# Altium project ngh-main.PrjPCB
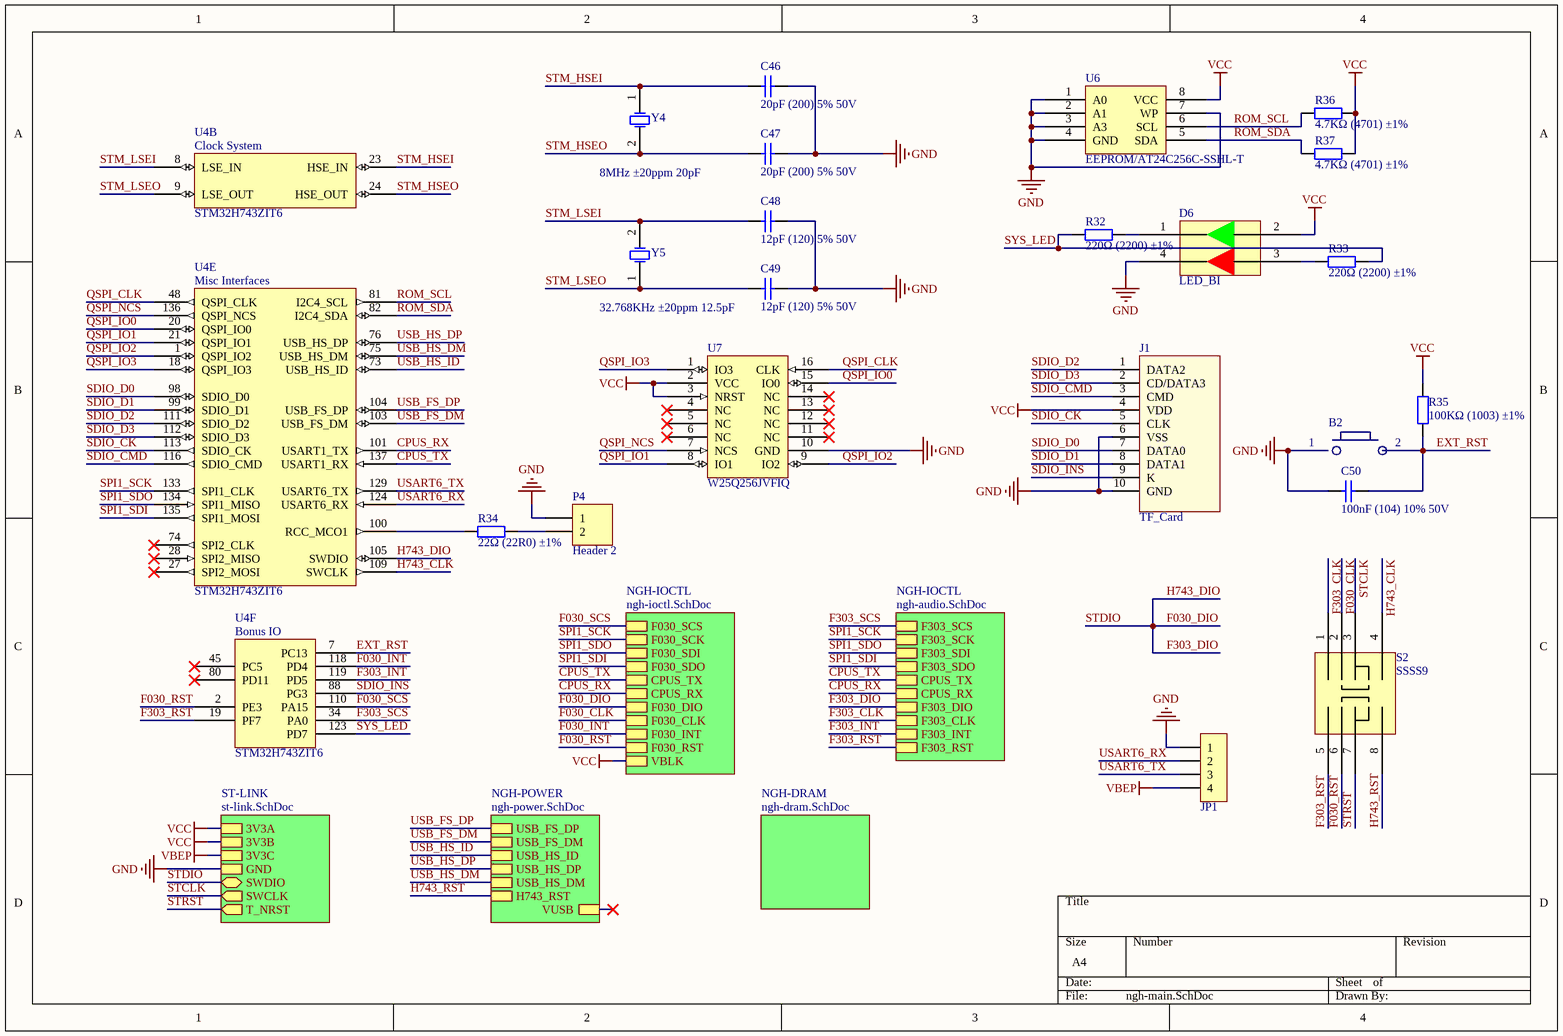
[diagram p0: ngh-main.SchDoc]
7 sheets, 143 parts. Net scope: hierarchical (ports join the sheet entries above them; power ports are global).
Board file: ngh-main.PcbDoc
Sheets:
  ngh-main.SchDoc
    ST-LINK = st-link.SchDoc
    NGH-POWER = ngh-power.SchDoc
    NGH-IOCTL = ngh-ioctl.SchDoc
      NGH-LCD = ngh-lcd.SchDoc
    NGH-IOCTL = ngh-audio.SchDoc
    NGH-DRAM = ngh-dram.SchDoc

## Sheet ngh-main.SchDoc
size A4

### Parts
B2  B1  [MetalButton]  (value not drawn)
C46  20pF (200) 5% 50V  [0603_C]
C47  20pF (200) 5% 50V  [0603_C]
C48  12pF (120) 5% 50V  [0603_C]
C49  12pF (120) 5% 50V  [0603_C]
C50  100nF (104) 10% 50V  [0603_C]
D6  LED_BI  [LED_BI]
J1  TF_Card  [Micro SD]
JP1  HDR-1X4  [HDR2.54-WS-4P]  (value not drawn)
P4  Header 2  [HDR1X2]
R32  220Ω (2200) ±1%  [0603_R]
R33  220Ω (2200) ±1%  [0603_R]
R34  22Ω (22R0) ±1%  [0603_R]
R35  100KΩ (1003) ±1%  [0603_R]
R36  4.7KΩ (4701) ±1%  [0603_R]
R37  4.7KΩ (4701) ±1%  [0603_R]
S2  SSSS9  [SSSS9_5mm_H]
U4  STM32H743ZIT6  [LQFP-144_20x20]  (parts B,E,F of 6)
U6  EEPROM/AT24C256C-SSHL-T  [SOIC-8_150mil]
U7  W25Q256JVFIQ  [SOIC-16_300mil]
Y4  8MHz ±20ppm 20pF  [SMD-5032_2P]
Y5  32.768KHz ±20ppm 12.5pF  [SMD-3215_2P FC - 135]

### Sub-sheets
NGH-DRAM = ngh-dram.SchDoc: no entries
NGH-IOCTL = ngh-ioctl.SchDoc: F030_SCS, F030_SCK, F030_SDI, F030_SDO, CPUS_TX, CPUS_RX, F030_DIO, F030_CLK, F030_INT, F030_RST, VBLK
NGH-IOCTL = ngh-audio.SchDoc: F303_SCS, F303_SCK, F303_SDI, F303_SDO, CPUS_TX, CPUS_RX, F303_DIO, F303_CLK, F303_INT, F303_RST
NGH-POWER = ngh-power.SchDoc: USB_FS_DP, USB_FS_DM, USB_HS_ID, USB_HS_DP, USB_HS_DM, H743_RST, VUSB
ST-LINK = st-link.SchDoc: 3V3A, 3V3B, 3V3C, GND, SWDIO (bidir), SWCLK (out), T_NRST (out)

### Nets
GND: B2.1 C46.2 C47.2 C48.2 C49.2 C50.1 D6.4 J1.6(VSS) J1.10(GND) JP1.1 P4.1 U6.1(A0) U6.2(A1) U6.3(A3) U6.4(GND) U6.7(WP) U7.10(GND) ; sheet ST-LINK/GND
VBEP: JP1.4 ; sheet ST-LINK/3V3C  [project net OUT_3V3C]
VCC: D6.2 J1.4(VDD) R35.2 R36.1 R37.1 U6.8(VCC) U7.2(VCC) U7.3(NRST) ; sheet ST-LINK/3V3A, sheet ST-LINK/3V3B, sheet NGH-IOCTL/VBLK  [project net OUT_3V3A]
CPUS_RX: U4.101(USART1_TX) ; sheet NGH-IOCTL/CPUS_RX, sheet NGH-IOCTL/CPUS_RX
CPUS_TX: U4.137(USART1_RX) ; sheet NGH-IOCTL/CPUS_TX, sheet NGH-IOCTL/CPUS_TX
EXT_RST: B2.2 C50.2 R35.1 U4.7(PC13)
F030_CLK: S2.2 ; sheet NGH-IOCTL/F030_CLK
F030_DIO: U4.105(SWDIO) ; sheet ST-LINK/SWDIO, sheet NGH-IOCTL/F030_DIO, sheet NGH-IOCTL/F303_DIO  [also labelled F303_DIO, H743_DIO, STDIO]
F030_INT: U4.118(PD4) ; sheet NGH-IOCTL/F030_INT
F030_RST: S2.6 U4.2(PE3) ; sheet NGH-IOCTL/F030_RST
F030_SCS: U4.110(PA15) ; sheet NGH-IOCTL/F030_SCS
F303_CLK: S2.1 ; sheet NGH-IOCTL/F303_CLK
F303_INT: U4.119(PD5) ; sheet NGH-IOCTL/F303_INT
F303_RST: S2.5 U4.19(PF7) ; sheet NGH-IOCTL/F303_RST
F303_SCS: U4.34(PA0) ; sheet NGH-IOCTL/F303_SCS
H743_CLK: S2.4 U4.109(SWCLK)
H743_RST: S2.8 ; sheet NGH-POWER/H743_RST
QSPI_CLK: U4.48(QSPI_CLK) U7.16(CLK)
QSPI_IO0: U4.20(QSPI_IO0) U7.15(IO0)
QSPI_IO1: U4.21(QSPI_IO1) U7.8(IO1)
QSPI_IO2: U4.1(QSPI_IO2) U7.9(IO2)
QSPI_IO3: U4.18(QSPI_IO3) U7.1(IO3)
QSPI_NCS: U4.136(QSPI_NCS) U7.7(NCS)
ROM_SCL: R36.2 U4.81(I2C4_SCL) U6.6(SCL)
ROM_SDA: R37.2 U4.82(I2C4_SDA) U6.5(SDA)
SDIO_CK: J1.5(CLK) U4.113(SDIO_CK)
SDIO_CMD: J1.3(CMD) U4.116(SDIO_CMD)
SDIO_D0: J1.7(DATA0) U4.98(SDIO_D0)
SDIO_D1: J1.8(DATA1) U4.99(SDIO_D1)
SDIO_D2: J1.1(DATA2) U4.111(SDIO_D2)
SDIO_D3: J1.2(CD/DATA3) U4.112(SDIO_D3)
SDIO_INS: J1.9(K) U4.88(PG3)
SPI1_SCK: U4.133(SPI1_CLK) ; sheet NGH-IOCTL/F030_SCK, sheet NGH-IOCTL/F303_SCK
SPI1_SDI: U4.135(SPI1_MOSI) ; sheet NGH-IOCTL/F030_SDO, sheet NGH-IOCTL/F303_SDO
SPI1_SDO: U4.134(SPI1_MISO) ; sheet NGH-IOCTL/F030_SDI, sheet NGH-IOCTL/F303_SDI
STCLK: S2.3 ; sheet ST-LINK/SWCLK
STM_HSEI: C46.1 U4.23(HSE_IN) Y4.1(OSC1)
STM_HSEO: C47.1 U4.24(HSE_OUT) Y4.2(OSC2)
STM_LSEI: C48.1 U4.8(LSE_IN) Y5.2(OSC2)
STM_LSEO: C49.1 U4.9(LSE_OUT) Y5.1(OSC1)
STRST: S2.7 ; sheet ST-LINK/T_NRST
SYS_LED: R32.1 R33.2 U4.123(PD7)
USART6_RX: JP1.2 U4.124(USART6_RX)
USART6_TX: JP1.3 U4.129(USART6_TX)
USB_FS_DM: U4.103(USB_FS_DM) ; sheet NGH-POWER/USB_FS_DM
USB_FS_DP: U4.104(USB_FS_DP) ; sheet NGH-POWER/USB_FS_DP
USB_HS_DM: U4.75(USB_HS_DM) ; sheet NGH-POWER/USB_HS_DM
USB_HS_DP: U4.76(USB_HS_DP) ; sheet NGH-POWER/USB_HS_DP
USB_HS_ID: U4.73(USB_HS_ID) ; sheet NGH-POWER/USB_HS_ID
NetD6_1: D6.1 R32.2
NetD6_3: D6.3 R33.1
NetP4_2: P4.2 R34.2
NetR34_1: R34.1 U4.100(RCC_MCO1)

Not connected (* = marked no-connect by the designer): U4 27(SPI2_MOSI)* 28(SPI2_MISO)* 45(PC5)* 74(SPI2_CLK)* 80(PD11)*; U7 4(NC)* 5(NC)* 6(NC)* 11(NC)* 12(NC)* 13(NC)* 14(NC)*

### Notes on the sheet
- (in symbol STM32H743ZIT6, part B) Clock System
- (in symbol STM32H743ZIT6, part E) Misc Interfaces
- (in symbol STM32H743ZIT6, part F) Bonus IO

### Library data of the parts
B2 = MetalButton
C46 C47 = 0603 20pF (200) 5% 50V: 贴片电容; ComponentLink1Description: 供应商链接; ComponentLink1URL: http://www.szlcsc.com/product/details_2000.html; Package: 0603; Supplier: LC; SuppliersPartNumber: C1648
C48 C49 = 0603 12pF (120) 5% 50V: 贴片电容; ComponentLink1Description: 供应商链接; ComponentLink1URL: http://www.szlcsc.com/product/details_39506.html; Package: 0603; Supplier: LC; SuppliersPartNumber: C38523
C50 = 0603 100nF (104) 10% 50V: 贴片电容; ComponentLink1Description: 供应商链接; ComponentLink1URL: http://www.szlcsc.com/product/details_15331.html; Package: 0603; Supplier: LC; SuppliersPartNumber: C14663
J1 = TF_Card: TF卡座; 版权归属: 源创客; BOM名称: TF卡座; 学习资源: www.ooocke.com
JP1 = Header 4: 4P接插件; 版权归属: 源创客; BOM名称: 4P接插件; 学习资源: www.ooocke.com
P4 = Header 2: Header, 2-Pin; LatestRevisionDate: 17-Jul-2002; LatestRevisionNote: Re-released for DXP Platform.; Publisher: Altium Limited
R32 R33 = 0603 220Ω (2200) 1%: 贴片电阻; ComponentLink1Description: 供应商链接; ComponentLink1URL: http://www.szlcsc.com/product/details_23689.html; Package: 0603; Supplier: LC; SuppliersPartNumber: C22962
R34 = 0603 22Ω (22R0) 1%: 贴片电阻; ComponentLink1Description: 供应商链接; ComponentLink1URL: http://www.szlcsc.com/product/details_24078.html; Package: 0603; Supplier: LC; SuppliersPartNumber: C23345
R35 = 0603 100KΩ (1003) 1%: 贴片电阻; ComponentLink1Description: 供应商链接; ComponentLink1URL: http://www.szlcsc.com/product/details_26546.html; Package: 0603; Supplier: LC; SuppliersPartNumber: C25803
R36 R37 = 0603 4.7KΩ (4701) 1%: 贴片电阻; ComponentLink1Description: 供应商链接; ComponentLink1URL: http://www.szlcsc.com/product/details_23889.html; Package: 0603; Supplier: LC; SuppliersPartNumber: C23162
U6 = EEPROM/AT24C256C-SSHL-T_[C6482]: EEPROM; ComponentLink1Description: 供应商链接; ComponentLink1URL: http://www.szlcsc.com/product/details_6947.html; Package: SOIC-8_150mil; Supplier: LC; SuppliersPartNumber: C6482
Y4 = SMD-5032_2P 8MHz 20ppm 20pF: 贴片晶振; ComponentLink1Description: 供应商链接; ComponentLink1URL: http://www.szlcsc.com/product/details_117214.html; Package: SMD-5032_2P; Supplier: LC; SuppliersPartNumber: C115962
Y5 = SMD-3215_2P 32.768KHz 20ppm 12.5pF: 贴片晶振; ComponentLink1Description: 供应商链接; ComponentLink1URL: http://www.szlcsc.com/product/details_33310.html; Package: SMD-3215_2P; Supplier: LC; SuppliersPartNumber: C32346

## Sheet st-link.SchDoc
size A4
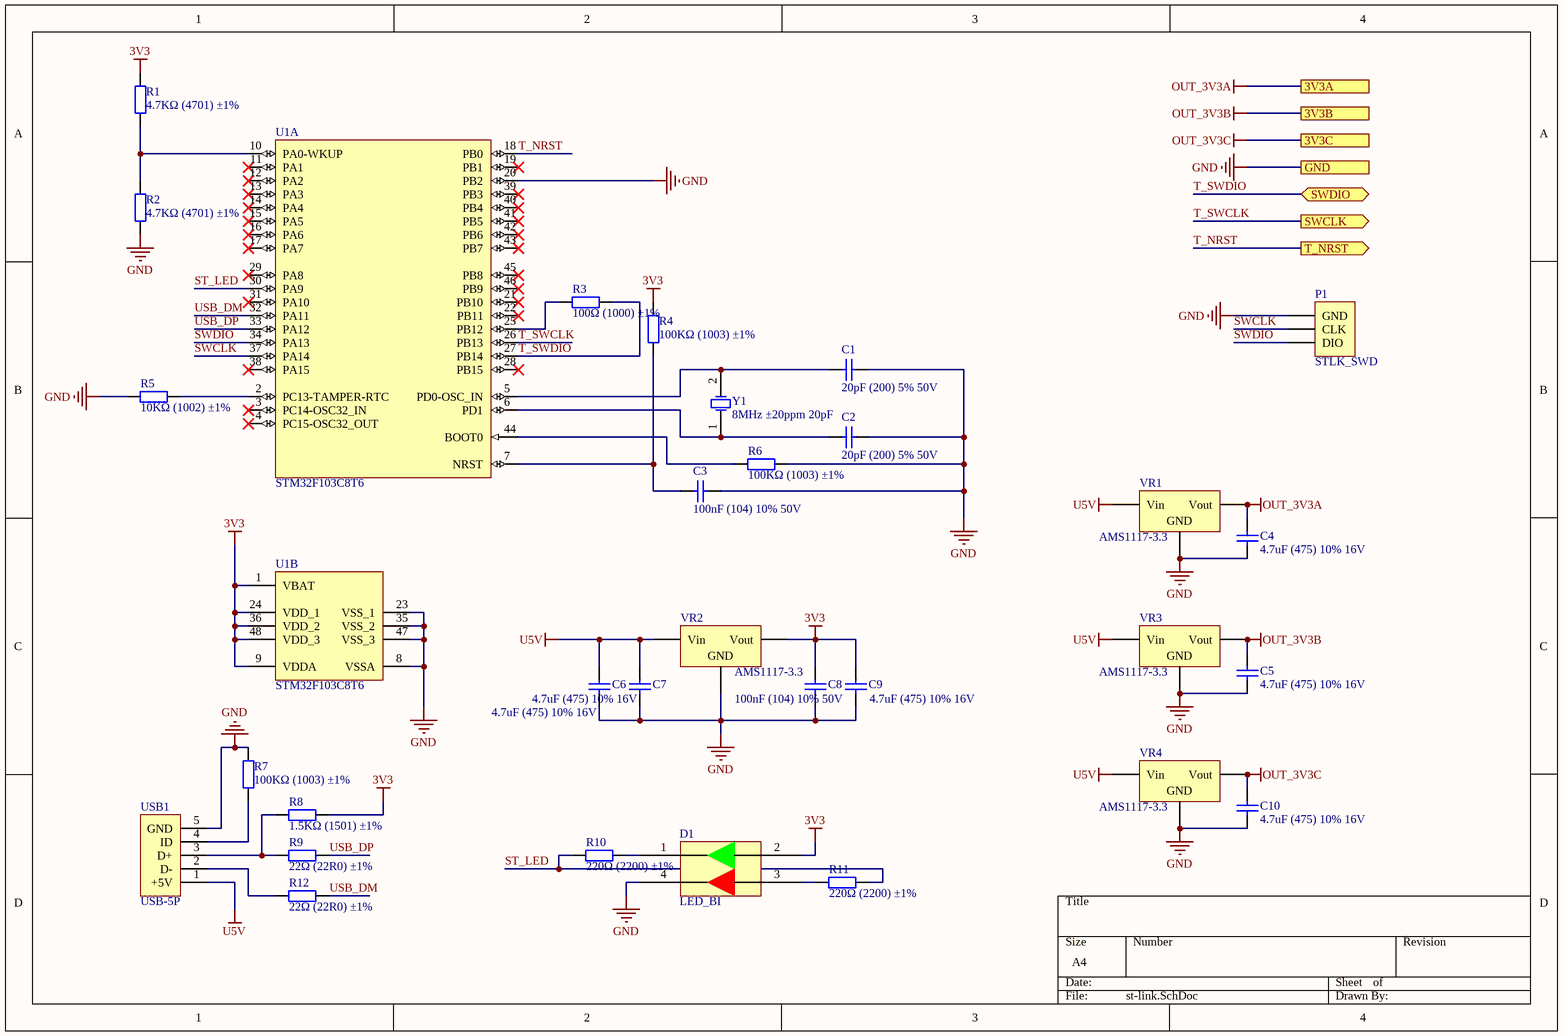
[diagram p1: st-link.SchDoc]

### Parts
C1  20pF (200) 5% 50V  [0603_C]
C2  20pF (200) 5% 50V  [0603_C]
C3  100nF (104) 10% 50V  [0603_C]
C4  4.7uF (475) 10% 16V  [0603_C]
C5  4.7uF (475) 10% 16V  [0603_C]
C6  4.7uF (475) 10% 16V  [0603_C]
C7  4.7uF (475) 10% 16V  [0603_C]
C8  100nF (104) 10% 50V  [0603_C]
C9  4.7uF (475) 10% 16V  [0603_C]
C10  4.7uF (475) 10% 16V  [0603_C]
D1  LED_BI  [LED_BI]
P1  STLK_SWD  [HDR1X3]
R1  4.7KΩ (4701) ±1%  [0603_R]
R2  4.7KΩ (4701) ±1%  [0603_R]
R3  100Ω (1000) ±1%  [0603_R]
R4  100KΩ (1003) ±1%  [0603_R]
R5  10KΩ (1002) ±1%  [0603_R]
R6  100KΩ (1003) ±1%  [0603_R]
R7  100KΩ (1003) ±1%  [0603_R]
R8  1.5KΩ (1501) ±1%  [0603_R]
R9  22Ω (22R0) ±1%  [0603_R]
R10  220Ω (2200) ±1%  [0603_R]
R11  220Ω (2200) ±1%  [0603_R]
R12  22Ω (22R0) ±1%  [0603_R]
U1  STM32F103C8T6  [LQFP-48_7x7x05P]  (parts A,B of 2)
USB1  USB-5P  [USB-MICRO_D]
VR1  AMS1117-3.3  [SOT-223]
VR2  AMS1117-3.3  [SOT-223]
VR3  AMS1117-3.3  [SOT-223]
VR4  AMS1117-3.3  [SOT-223]
Y1  8MHz ±20ppm 20pF  [SMD-5032_2P]

### Ports
3V3A, 3V3B, 3V3C, GND, SWCLK (out), SWDIO (bidir), T_NRST (out)

### Nets
3V3: C8.2 C9.2 D1.2 R1.2 R4.2 R8.2 U1.1(VBAT) U1.9(VDDA) U1.24(VDD_1) U1.36(VDD_2) U1.48(VDD_3) VR2.2(Vout)
GND: C1.2 C2.2 C3.1 C4.1 C5.1 C6.1 C7.1 C8.1 C9.1 C10.1 D1.4 P1.1(GND) R2.1 R5.1 R6.2 R7.2 U1.8(VSSA) U1.20(PB2) U1.23(VSS_1) U1.35(VSS_2) U1.47(VSS_3) USB1.5(GND) VR1.1(GND) VR2.1(GND) VR3.1(GND) VR4.1(GND) ; port GND
OUT_3V3A: C4.2 C5.2 VR1.2(Vout) VR3.2(Vout) ; port 3V3B, port 3V3A  [also labelled OUT_3V3B]
OUT_3V3C: C10.2 VR4.2(Vout) ; port 3V3C
U5V: C6.2 C7.2 USB1.1(+5V) VR1.3(Vin) VR2.3(Vin) VR3.3(Vin) VR4.3(Vin)
ST_LED: R10.1 R11.2 U1.30(PA9)
SWCLK: P1.2(CLK) U1.37(PA14)
SWDIO: P1.3(DIO) U1.34(PA13)
T_NRST: U1.18(PB0) ; port T_NRST  [project net STRST]
T_SWCLK: U1.26(PB13) ; port SWCLK  [project net STCLK]
T_SWDIO: R3.2 U1.27(PB14) ; port SWDIO  [project net F030_DIO]
USB_DM: R12.2 U1.32(PA11)
USB_DP: R9.2 U1.33(PA12)
NetC1_1: C1.1 U1.5(PD0-OSC_IN) Y1.2(OSC2)
NetC2_1: C2.1 U1.6(PD1) Y1.1(OSC1)
NetC3_2: C3.2 R4.1 U1.7(NRST)
NetD1_1: D1.1 R10.2
NetD1_3: D1.3 R11.1
NetR1_1: R1.1 R2.2 U1.10(PA0-WKUP)
NetR3_1: R3.1 U1.25(PB12)
NetR5_2: R5.2 U1.2(PC13-TAMPER-RTC)
NetR6_1: R6.1 U1.44(BOOT0)
NetR7_1: R7.1 USB1.4(ID)
NetR8_1: R8.1 R9.1 USB1.3(D+)
NetR12_1: R12.1 USB1.2(D-)

Not connected (* = marked no-connect by the designer): U1 3(PC14-OSC32_IN)* 4(PC15-OSC32_OUT)* 11(PA1)* 12(PA2)* 13(PA3)* 14(PA4)* 15(PA5)* 16(PA6)* 17(PA7)* 19(PB1)* 21(PB10)* 22(PB11)* 28(PB15)* 29(PA8)* 31(PA10)* 38(PA15)* 39(PB3)* 40(PB4)* 41(PB5)* 42(PB6)* 43(PB7)* 45(PB8)* 46(PB9)*

### Library data of the parts
C1 C2 = 0603 20pF (200) 5% 50V: 贴片电容; ComponentLink1Description: 供应商链接; ComponentLink1URL: http://www.szlcsc.com/product/details_2000.html; Package: 0603; Supplier: LC; SuppliersPartNumber: C1648
C3 C8 = 0603 100nF (104) 10% 50V: 贴片电容; ComponentLink1Description: 供应商链接; ComponentLink1URL: http://www.szlcsc.com/product/details_15331.html; Package: 0603; Supplier: LC; SuppliersPartNumber: C14663
C4-C7 C9 C10 = 0603 4.7uF (475) 10% 16V: 贴片电容; ComponentLink1Description: 供应商链接; ComponentLink1URL: http://www.szlcsc.com/product/details_20375.html; Package: 0603; Supplier: LC; SuppliersPartNumber: C19666
P1 = Header 3: Header, 3-Pin; LatestRevisionDate: 17-Jul-2002; LatestRevisionNote: Re-released for DXP Platform.; Publisher: Altium Limited
R1 R2 = 0603 4.7KΩ (4701) 1%: 贴片电阻; ComponentLink1Description: 供应商链接; ComponentLink1URL: http://www.szlcsc.com/product/details_23889.html; Package: 0603; Supplier: LC; SuppliersPartNumber: C23162
R3 = 0603 100Ω (1000) 1%: 贴片电阻; ComponentLink1Description: 供应商链接; ComponentLink1URL: http://www.szlcsc.com/product/details_23502.html; Package: 0603; Supplier: LC; SuppliersPartNumber: C22775
R4 R6 R7 = 0603 100KΩ (1003) 1%: 贴片电阻; ComponentLink1Description: 供应商链接; ComponentLink1URL: http://www.szlcsc.com/product/details_26546.html; Package: 0603; Supplier: LC; SuppliersPartNumber: C25803
R5 = 0603 10KΩ (1002) 1%: 贴片电阻; ComponentLink1Description: 供应商链接; ComponentLink1URL: http://www.szlcsc.com/product/details_26547.html; Package: 0603; Supplier: LC; SuppliersPartNumber: C25804
R8 = 0603 1.5KΩ (1501) 1%: 贴片电阻; ComponentLink1Description: 供应商链接; ComponentLink1URL: http://www.szlcsc.com/product/details_23570.html; Package: 0603; Supplier: LC; SuppliersPartNumber: C22843
R9 R12 = 0603 22Ω (22R0) 1%: 贴片电阻; ComponentLink1Description: 供应商链接; ComponentLink1URL: http://www.szlcsc.com/product/details_24078.html; Package: 0603; Supplier: LC; SuppliersPartNumber: C23345
R10 R11 = 0603 220Ω (2200) 1%: 贴片电阻; ComponentLink1Description: 供应商链接; ComponentLink1URL: http://www.szlcsc.com/product/details_23689.html; Package: 0603; Supplier: LC; SuppliersPartNumber: C22962
U1 = STM32F103C8T6: ARM; ComponentLink1Description: 供应商链接; ComponentLink1URL: http://www.szlcsc.com/product/details_9243.html; Package: LQFP-48_7x7x05P; Supplier: LC; SuppliersPartNumber: C8734
USB1 = USB-5P: 微型USB母座; 版权归属: 源创客; BOM名称: 微型USB母座; 学习资源: www.ooocke.com
VR1-VR4 = SOT-223 AMS1117-3.3: 低压差线性稳压(LDO); ComponentLink1Description: 供应商链接; ComponentLink1URL: http://www.szlcsc.com/product/details_6652.html; Package: SOT-223; Supplier: LC; SuppliersPartNumber: C6186
Y1 = SMD-5032_2P 8MHz 20ppm 20pF: 贴片晶振; ComponentLink1Description: 供应商链接; ComponentLink1URL: http://www.szlcsc.com/product/details_117214.html; Package: SMD-5032_2P; Supplier: LC; SuppliersPartNumber: C115962

## Sheet ngh-power.SchDoc
size A4
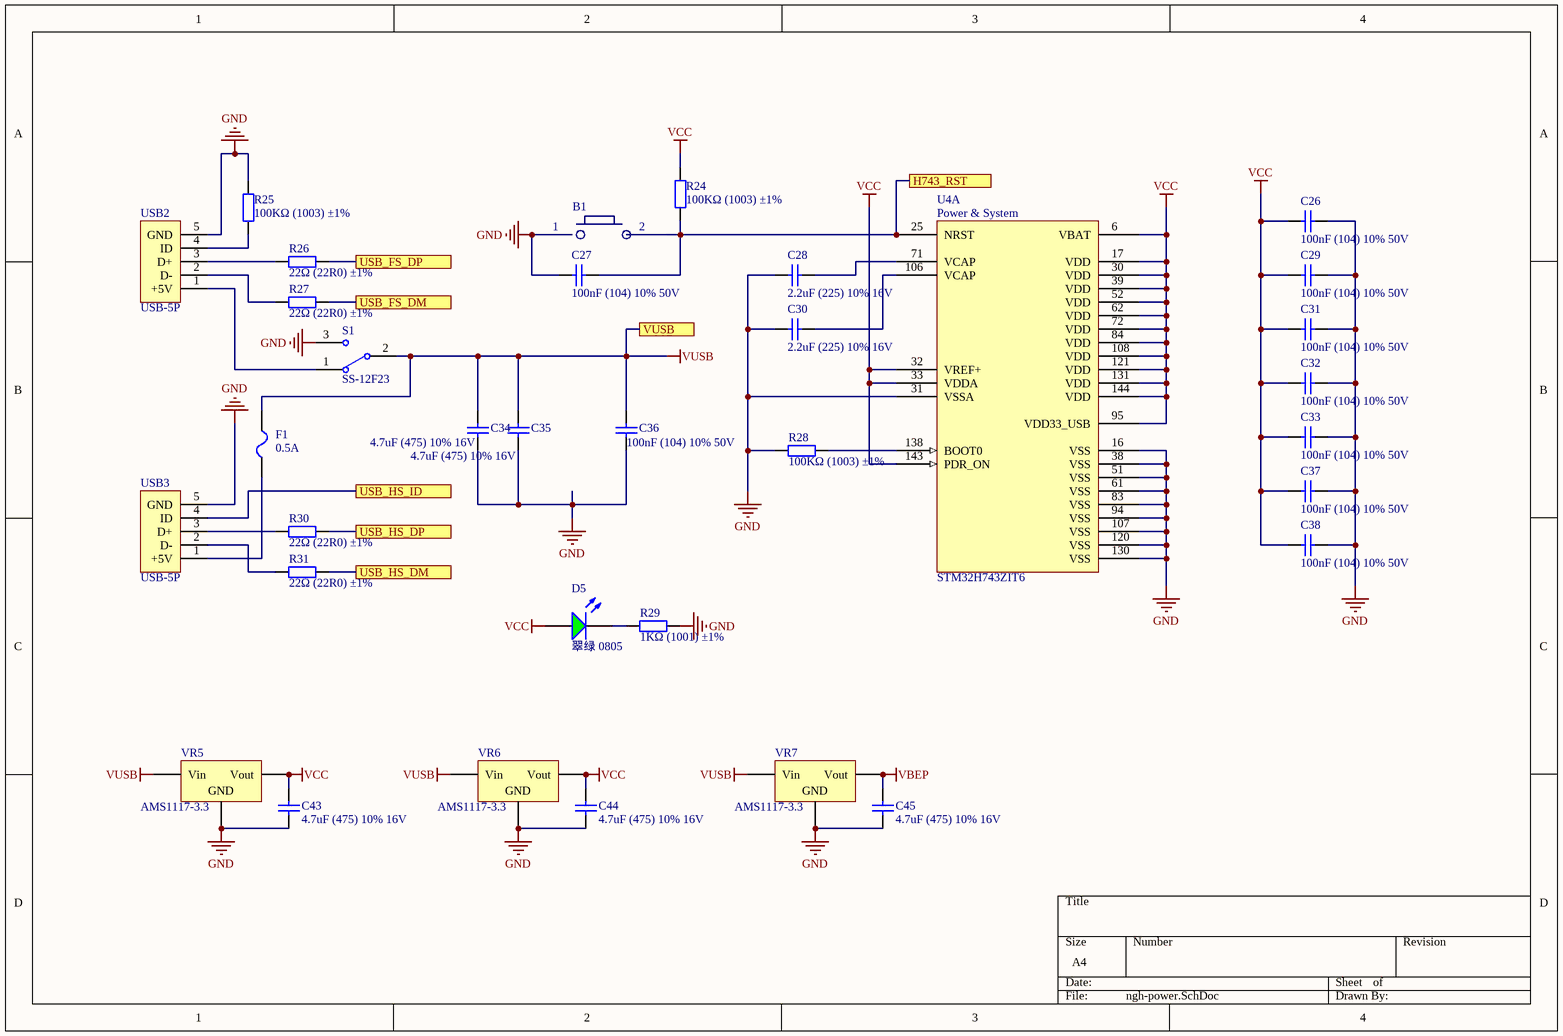
[diagram p2: ngh-power.SchDoc]

### Parts
B1  B1  [MetalButton]  (value not drawn)
C26  100nF (104) 10% 50V  [0603_C]
C27  100nF (104) 10% 50V  [0603_C]
C28  2.2uF (225) 10% 16V  [0603_C]
C29  100nF (104) 10% 50V  [0603_C]
C30  2.2uF (225) 10% 16V  [0603_C]
C31  100nF (104) 10% 50V  [0603_C]
C32  100nF (104) 10% 50V  [0603_C]
C33  100nF (104) 10% 50V  [0603_C]
C34  4.7uF (475) 10% 16V  [0603_C]
C35  4.7uF (475) 10% 16V  [0603_C]
C36  100nF (104) 10% 50V  [0603_C]
C37  100nF (104) 10% 50V  [0603_C]
C38  100nF (104) 10% 50V  [0603_C]
C43  4.7uF (475) 10% 16V  [0603_C]
C44  4.7uF (475) 10% 16V  [0603_C]
C45  4.7uF (475) 10% 16V  [0603_C]
D5  翠绿 0805  [0805_LED_S1]
F1  0.5A  [FU 0603]
R24  100KΩ (1003) ±1%  [0603_R]
R25  100KΩ (1003) ±1%  [0603_R]
R26  22Ω (22R0) ±1%  [0603_R]
R27  22Ω (22R0) ±1%  [0603_R]
R28  100KΩ (1003) ±1%  [0603_R]
R29  1KΩ (1001) ±1%  [0603_R]
R30  22Ω (22R0) ±1%  [0603_R]
R31  22Ω (22R0) ±1%  [0603_R]
S1  SS-12F23  [SS-12F23]
U4  STM32H743ZIT6  [LQFP-144_20x20]  (part A of 6)
USB2  USB-5P  [USB-MICRO_D]
USB3  USB-5P  [USB-MICRO_D]
VR5  AMS1117-3.3  [SOT-223]
VR6  AMS1117-3.3  [SOT-223]
VR7  AMS1117-3.3  [SOT-223]

### Ports
H743_RST, USB_FS_DM, USB_FS_DP, USB_HS_DM, USB_HS_DP, USB_HS_ID, VUSB

### Nets
GND: B1.1 C26.1 C27.1 C28.1 C29.1 C30.1 C31.1 C32.1 C33.1 C34.1 C35.1 C36.1 C37.1 C38.1 C43.1 C44.1 C45.1 R25.2 R28.2 R29.1 S1.3 U4.16(VSS) U4.31(VSSA) U4.38(VSS) U4.51(VSS) U4.61(VSS) U4.83(VSS) U4.94(VSS) U4.107(VSS) U4.120(VSS) U4.130(VSS) USB2.5(GND) USB3.5(GND) VR5.1(GND) VR6.1(GND) VR7.1(GND)
VBEP: C45.2 VR7.2(Vout)  [project net OUT_3V3C]
VCC: C26.2 C29.2 C31.2 C32.2 C33.2 C37.2 C38.2 C43.2 C44.2 D5.A R24.2 U4.6(VBAT) U4.17(VDD) U4.30(VDD) U4.32(VREF+) U4.33(VDDA) U4.39(VDD) U4.52(VDD) U4.62(VDD) U4.72(VDD) U4.84(VDD) U4.95(VDD33_USB) U4.108(VDD) U4.121(VDD) U4.131(VDD) U4.143(PDR_ON) U4.144(VDD) VR5.2(Vout) VR6.2(Vout)  [project net OUT_3V3A]
VUSB: C34.2 C35.2 C36.2 F1.2 S1.2 VR5.3(Vin) VR6.3(Vin) VR7.3(Vin) ; port VUSB
H743_RST: B1.2 C27.2 R24.1 U4.25(NRST) ; port H743_RST
USB_FS_DM: R27.2 ; port USB_FS_DM
USB_FS_DP: R26.2 ; port USB_FS_DP
USB_HS_DM: R31.2 ; port USB_HS_DM
USB_HS_DP: R30.2 ; port USB_HS_DP
USB_HS_ID: USB3.4(ID) ; port USB_HS_ID
NetC28_2: C28.2 U4.71(VCAP)
NetC30_2: C30.2 U4.106(VCAP)
NetD5_K: D5.K R29.2
NetF1_1: F1.1 USB3.1(+5V)
NetR25_1: R25.1 USB2.4(ID)
NetR26_1: R26.1 USB2.3(D+)
NetR27_1: R27.1 USB2.2(D-)
NetR28_1: R28.1 U4.138(BOOT0)
NetR30_1: R30.1 USB3.3(D+)
NetR31_1: R31.1 USB3.2(D-)
NetS1_1: S1.1 USB2.1(+5V)

### Notes on the sheet
- (in symbol STM32H743ZIT6, part A) Power & System

### Library data of the parts
B1 = MetalButton
C26 C27 C29 C31-C33 C36-C38 = 0603 100nF (104) 10% 50V: 贴片电容; ComponentLink1Description: 供应商链接; ComponentLink1URL: http://www.szlcsc.com/product/details_15331.html; Package: 0603; Supplier: LC; SuppliersPartNumber: C14663
C28 C30 = 0603 2.2uF (225) 10% 16V: 贴片电容; ComponentLink1Description: 供应商链接; ComponentLink1URL: http://www.szlcsc.com/product/details_24366.html; Package: 0603; Supplier: LC; SuppliersPartNumber: C23630
C34 C35 C43-C45 = 0603 4.7uF (475) 10% 16V: 贴片电容; ComponentLink1Description: 供应商链接; ComponentLink1URL: http://www.szlcsc.com/product/details_20375.html; Package: 0603; Supplier: LC; SuppliersPartNumber: C19666
D5 = 0805 翠绿: 发光二极管; ComponentLink1Description: 供应商链接; ComponentLink1URL: http://www.szlcsc.com/product/details_2670.html; Package: 0805; Supplier: LC; SuppliersPartNumber: C2297
F1 = FU: 贴片保险丝; 版权归属: 源创客; BOM名称: 贴片保险丝; 学习资源: www.ooocke.com
R24 R25 R28 = 0603 100KΩ (1003) 1%: 贴片电阻; ComponentLink1Description: 供应商链接; ComponentLink1URL: http://www.szlcsc.com/product/details_26546.html; Package: 0603; Supplier: LC; SuppliersPartNumber: C25803
R26 R27 R30 R31 = 0603 22Ω (22R0) 1%: 贴片电阻; ComponentLink1Description: 供应商链接; ComponentLink1URL: http://www.szlcsc.com/product/details_24078.html; Package: 0603; Supplier: LC; SuppliersPartNumber: C23345
R29 = 0603 1KΩ (1001) 1%: 贴片电阻; ComponentLink1Description: 供应商链接; ComponentLink1URL: http://www.szlcsc.com/product/details_21904.html; Package: 0603; Supplier: LC; SuppliersPartNumber: C21190
S1 = SSW-1P: 1路波动开关; BOM名称: 波动开关; 版权归属: 源创客; 学习资源: www.ooocke.com
USB2 USB3 = USB-5P: 微型USB母座; 版权归属: 源创客; BOM名称: 微型USB母座; 学习资源: www.ooocke.com
VR5-VR7 = SOT-223 AMS1117-3.3: 低压差线性稳压(LDO); ComponentLink1Description: 供应商链接; ComponentLink1URL: http://www.szlcsc.com/product/details_6652.html; Package: SOT-223; Supplier: LC; SuppliersPartNumber: C6186

## Sheet ngh-ioctl.SchDoc
size A4
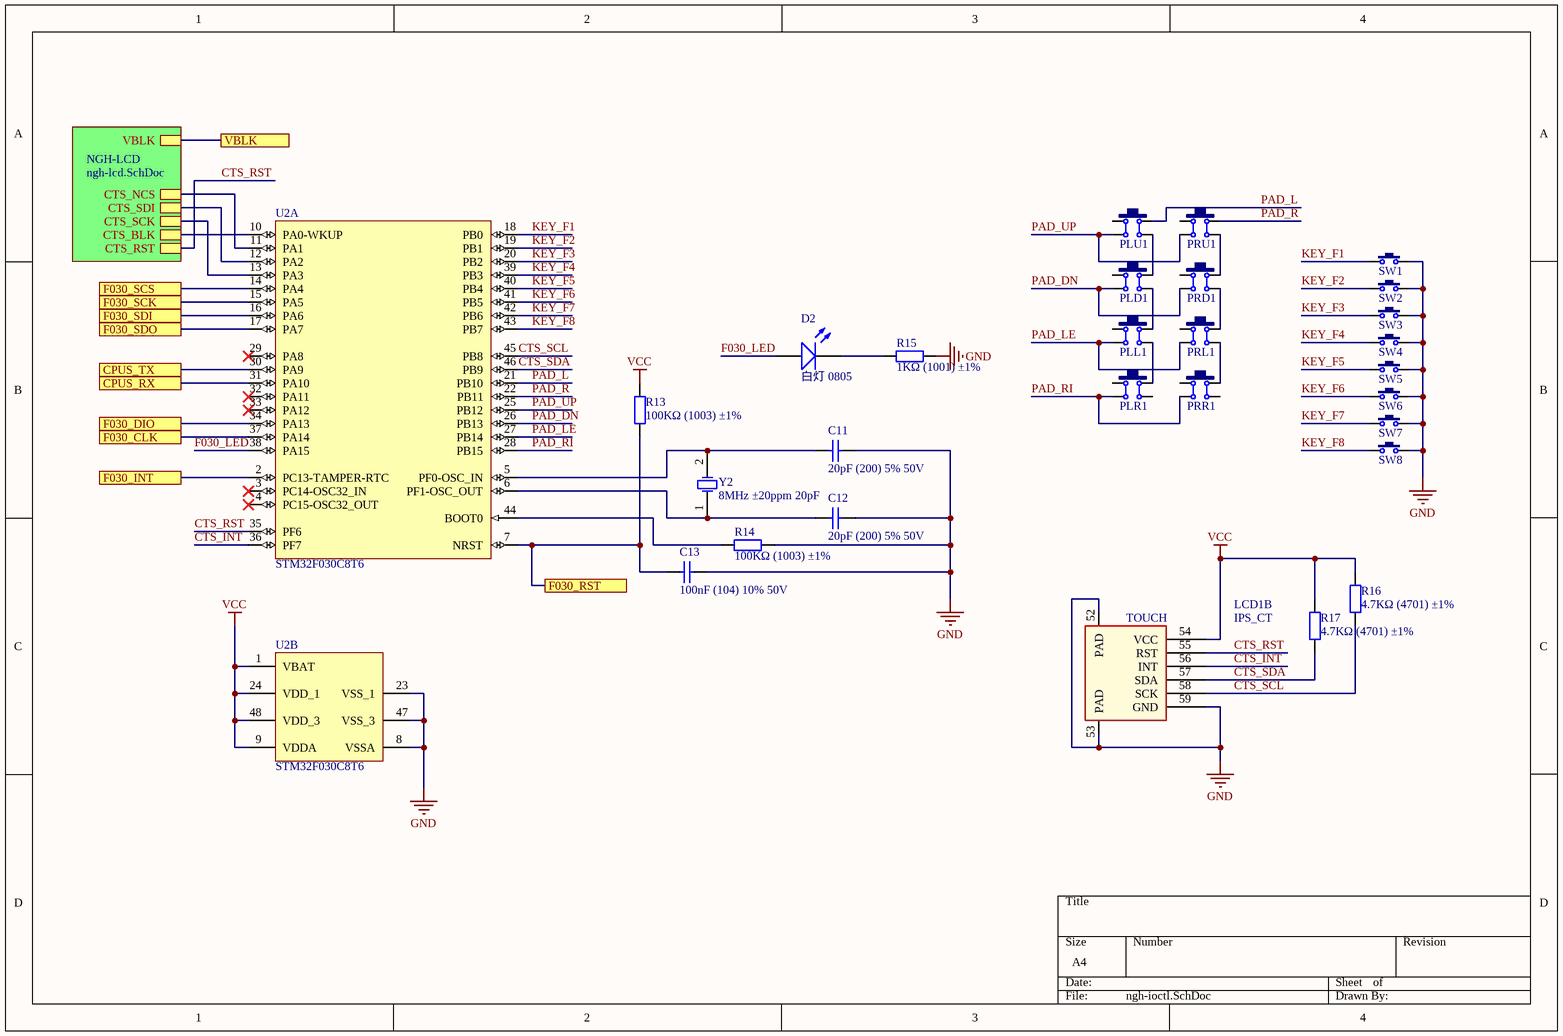
[diagram p3: ngh-ioctl.SchDoc]

### Parts
C11  20pF (200) 5% 50V  [0603_C]
C12  20pF (200) 5% 50V  [0603_C]
C13  100nF (104) 10% 50V  [0603_C]
D2  白灯 0805  [0805_LED_S1]
LCD1  IPS_CT  [IPS_CT]  (part B of 3)
PLD1  12x12x5  [TSW SMD-12*12*6]  (value not drawn)
PLL1  12x12x5  [TSW SMD-12*12*6]  (value not drawn)
PLR1  12x12x5  [TSW SMD-12*12*6]  (value not drawn)
PLU1  12x12x5  [TSW SMD-12*12*6]  (value not drawn)
PRD1  12x12x5  [TSW SMD-12*12*6]  (value not drawn)
PRL1  12x12x5  [TSW SMD-12*12*6]  (value not drawn)
PRR1  12x12x5  [TSW SMD-12*12*6]  (value not drawn)
PRU1  12x12x5  [TSW SMD-12*12*6]  (value not drawn)
R13  100KΩ (1003) ±1%  [0603_R]
R14  100KΩ (1003) ±1%  [0603_R]
R15  1KΩ (1001) ±1%  [0603_R]
R16  4.7KΩ (4701) ±1%  [0603_R]
R17  4.7KΩ (4701) ±1%  [0603_R]
SW1  3x6x5  [TSW SMD-3*6*4.3]  (value not drawn)
SW2  3x6x5  [TSW SMD-3*6*4.3]  (value not drawn)
SW3  3x6x5  [TSW SMD-3*6*4.3]  (value not drawn)
SW4  3x6x5  [TSW SMD-3*6*4.3]  (value not drawn)
SW5  3x6x5  [TSW SMD-3*6*4.3]  (value not drawn)
SW6  3x6x5  [TSW SMD-3*6*4.3]  (value not drawn)
SW7  3x6x5  [TSW SMD-3*6*4.3]  (value not drawn)
SW8  3x6x5  [TSW SMD-3*6*4.3]  (value not drawn)
U2  STM32F030C8T6  [LQFP-48_7x7x05P]  (parts A,B of 2)
Y2  8MHz ±20ppm 20pF  [SMD-5032_2P]

### Sub-sheets
NGH-LCD = ngh-lcd.SchDoc: CTS_BLK, VBLK, CTS_RST, CTS_SDI, CTS_SCK, CTS_NCS

### Ports
CPUS_RX, CPUS_TX, F030_CLK, F030_DIO, F030_INT, F030_RST, F030_SCK, F030_SCS, F030_SDI, F030_SDO, VBLK

### Nets
GND: C11.2 C12.2 C13.1 LCD1.52(PAD) LCD1.53(PAD) LCD1.59(GND) R14.2 R15.2 SW1.2 SW2.2 SW3.2 SW4.2 SW5.2 SW6.2 SW7.2 SW8.2 U2.8(VSSA) U2.23(VSS_1) U2.47(VSS_3)
VCC: LCD1.54(VCC) R13.2 R16.2 R17.2 U2.1(VBAT) U2.9(VDDA) U2.24(VDD_1) U2.48(VDD_3) ; port VBLK, sheet NGH-LCD/VBLK  [project net OUT_3V3A]
CPUS_RX: U2.31(PA10) ; port CPUS_RX
CPUS_TX: U2.30(PA9) ; port CPUS_TX
CTS_INT: LCD1.56(INT) U2.36(PF7)
CTS_RST: LCD1.55(RST) U2.35(PF6) ; sheet NGH-LCD/CTS_RST
CTS_SCL: LCD1.58(SCK) R16.1 U2.45(PB8)
CTS_SDA: LCD1.57(SDA) R17.1 U2.46(PB9)
F030_CLK: U2.37(PA14) ; port F030_CLK
F030_DIO: U2.34(PA13) ; port F030_DIO
F030_INT: U2.2(PC13-TAMPER-RTC) ; port F030_INT
F030_LED: D2.A U2.38(PA15)
F030_RST: C13.2 R13.1 U2.7(NRST) ; port F030_RST
F030_SCS: U2.14(PA4) ; port F030_SCS
KEY_F1: SW1.1 U2.18(PB0)
KEY_F2: SW2.1 U2.19(PB1)
KEY_F3: SW3.1 U2.20(PB2)
KEY_F4: SW4.1 U2.39(PB3)
KEY_F5: SW5.1 U2.40(PB4)
KEY_F6: SW6.1 U2.41(PB5)
KEY_F7: SW7.1 U2.42(PB6)
KEY_F8: SW8.1 U2.43(PB7)
PAD_DN: PLD1.4 PRD1.4 U2.26(PB13)
PAD_L: PLU1.2 U2.21(PB10)
PAD_LE: PLL1.4 PRL1.4 U2.27(PB14)
PAD_R: PRU1.2 U2.22(PB11)
PAD_RI: PLR1.4 PRR1.4 U2.28(PB15)
PAD_UP: PLU1.4 PRU1.4 U2.25(PB12)
SPI1_SCK: U2.15(PA5) ; port F030_SCK
SPI1_SDI: U2.17(PA7) ; port F030_SDO
SPI1_SDO: U2.16(PA6) ; port F030_SDI
NetC11_1: C11.1 U2.5(PF0-OSC_IN) Y2.2(OSC2)
NetC12_1: C12.1 U2.6(PF1-OSC_OUT) Y2.1(OSC1)
NetD2_K: D2.K R15.1
NetLCD1_8: U2.12(PA2) ; sheet NGH-LCD/CTS_SDI
NetLCD1_9: U2.11(PA1) ; sheet NGH-LCD/CTS_NCS
NetLCD1_11: U2.13(PA3) ; sheet NGH-LCD/CTS_SCK
NetPLD1_2: PLD1.2 PLU1.3
NetPLD1_3: PLD1.3 PLL1.2
NetPLL1_3: PLL1.3 PLR1.2
NetPRD1_2: PRD1.2 PRU1.3
NetPRD1_3: PRD1.3 PRL1.2
NetPRL1_3: PRL1.3 PRR1.2
NetR14_1: R14.1 U2.44(BOOT0)
NetU2_10: U2.10(PA0-WKUP) ; sheet NGH-LCD/CTS_BLK

Not connected (* = marked no-connect by the designer): PLD1 1; PLL1 1; PLR1 1 3; PLU1 1; PRD1 1; PRL1 1; PRR1 1 3; PRU1 1; U2 3(PC14-OSC32_IN)* 4(PC15-OSC32_OUT)* 29(PA8)* 32(PA11)* 33(PA12)*

### Notes on the sheet
- (in symbol IPS_CT, part B) TOUCH

### Library data of the parts
C11 C12 = 0603 20pF (200) 5% 50V: 贴片电容; ComponentLink1Description: 供应商链接; ComponentLink1URL: http://www.szlcsc.com/product/details_2000.html; Package: 0603; Supplier: LC; SuppliersPartNumber: C1648
C13 = 0603 100nF (104) 10% 50V: 贴片电容; ComponentLink1Description: 供应商链接; ComponentLink1URL: http://www.szlcsc.com/product/details_15331.html; Package: 0603; Supplier: LC; SuppliersPartNumber: C14663
D2 = 0805 白灯: 发光二极管; ComponentLink1Description: 供应商链接; ComponentLink1URL: http://www.szlcsc.com/product/details_35468.html; Package: 0805; Supplier: LC; SuppliersPartNumber: C34499
PLD1 PLL1 PLR1 PLU1 PRD1 PRL1 PRR1 PRU1 = TSW SMD-12x12: 贴片12x12轻触开关; 版权归属: 源创客; BOM名称: 贴片12x12轻触开关; 学习资源: www.ooocke.com
R13 R14 = 0603 100KΩ (1003) 1%: 贴片电阻; ComponentLink1Description: 供应商链接; ComponentLink1URL: http://www.szlcsc.com/product/details_26546.html; Package: 0603; Supplier: LC; SuppliersPartNumber: C25803
R15 = 0603 1KΩ (1001) 1%: 贴片电阻; ComponentLink1Description: 供应商链接; ComponentLink1URL: http://www.szlcsc.com/product/details_21904.html; Package: 0603; Supplier: LC; SuppliersPartNumber: C21190
R16 R17 = 0603 4.7KΩ (4701) 1%: 贴片电阻; ComponentLink1Description: 供应商链接; ComponentLink1URL: http://www.szlcsc.com/product/details_23889.html; Package: 0603; Supplier: LC; SuppliersPartNumber: C23162
SW1-SW8 = TSW 3x6: 3x6轻触开关; 版权归属: 源创客; BOM名称: 3x6轻触开关; 学习资源: www.ooocke.com
U2 = STM32F030C8T6: ARM; ComponentLink1Description: 供应商链接; ComponentLink1URL: http://www.szlcsc.com/product/details_9243.html; Package: LQFP-48_7x7x05P; Supplier: LC; SuppliersPartNumber: C8734
Y2 = SMD-5032_2P 8MHz 20ppm 20pF: 贴片晶振; ComponentLink1Description: 供应商链接; ComponentLink1URL: http://www.szlcsc.com/product/details_117214.html; Package: SMD-5032_2P; Supplier: LC; SuppliersPartNumber: C115962

## Sheet ngh-lcd.SchDoc
size A4
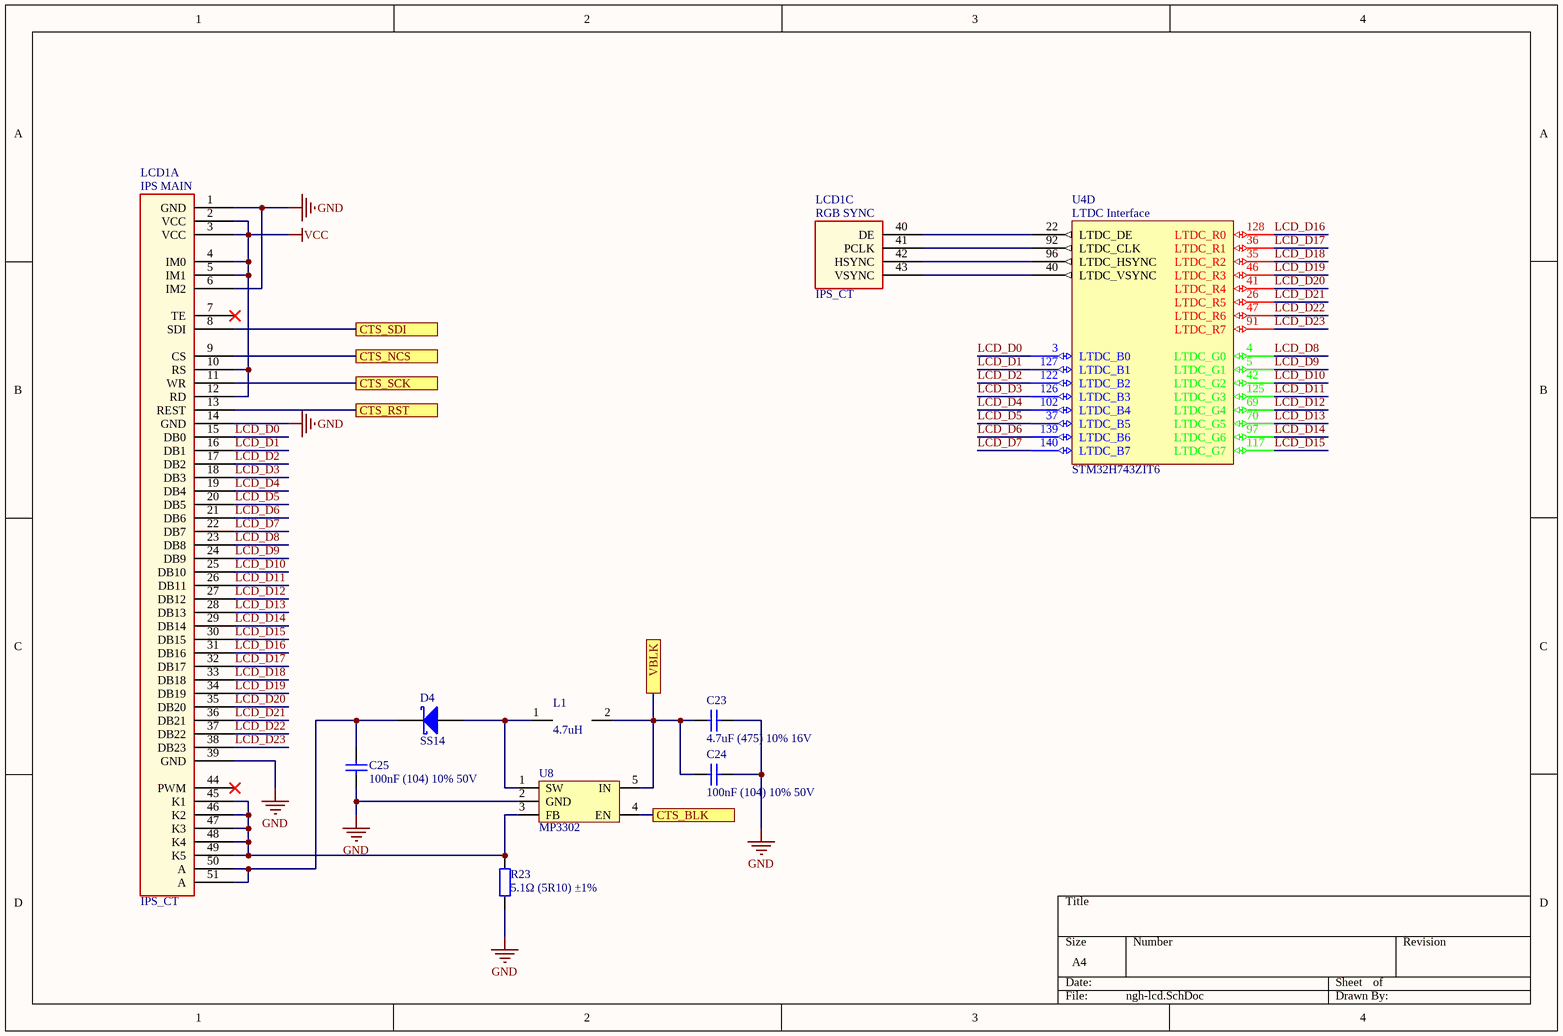
[diagram p4: ngh-lcd.SchDoc]

### Parts
C23  4.7uF (475) 10% 16V  [0603_C]
C24  100nF (104) 10% 50V  [0603_C]
C25  100nF (104) 10% 50V  [0603_C]
D4  SS14  [SOD123]
L1  4.7uH  [L453226]
LCD1  IPS_CT  [IPS_CT]  (parts A,C of 3)
R23  5.1Ω (5R10) ±1%  [0603_R]
U4  STM32H743ZIT6  [LQFP-144_20x20]  (part D of 6)
U8  MP3302  [SOT23-5]

### Ports
CTS_BLK, CTS_NCS, CTS_RST, CTS_SCK, CTS_SDI, VBLK

### Nets
GND: C23.2 C24.2 C25.1 LCD1.1(GND) LCD1.6(IM2) LCD1.14(GND) LCD1.39(GND) R23.1 U8.2(GND)
VCC: C23.1 C24.1 L1.2 LCD1.2(VCC) LCD1.3(VCC) LCD1.4(IM0) LCD1.5(IM1) LCD1.10(RS) LCD1.12(RD) U8.5(IN) ; port VBLK  [project net OUT_3V3A]
CTS_RST: LCD1.13(REST) ; port CTS_RST
LCD_D0: LCD1.15(DB0) U4.3(LTDC_B0)
LCD_D1: LCD1.16(DB1) U4.127(LTDC_B1)
LCD_D2: LCD1.17(DB2) U4.122(LTDC_B2)
LCD_D3: LCD1.18(DB3) U4.126(LTDC_B3)
LCD_D4: LCD1.19(DB4) U4.102(LTDC_B4)
LCD_D5: LCD1.20(DB5) U4.37(LTDC_B5)
LCD_D6: LCD1.21(DB6) U4.139(LTDC_B6)
LCD_D7: LCD1.22(DB7) U4.140(LTDC_B7)
LCD_D8: LCD1.23(DB8) U4.4(LTDC_G0)
LCD_D9: LCD1.24(DB9) U4.5(LTDC_G1)
LCD_D10: LCD1.25(DB10) U4.42(LTDC_G2)
LCD_D11: LCD1.26(DB11) U4.125(LTDC_G3)
LCD_D12: LCD1.27(DB12) U4.69(LTDC_G4)
LCD_D13: LCD1.28(DB13) U4.70(LTDC_G5)
LCD_D14: LCD1.29(DB14) U4.97(LTDC_G6)
LCD_D15: LCD1.30(DB15) U4.117(LTDC_G7)
LCD_D16: LCD1.31(DB16) U4.128(LTDC_R0)
LCD_D17: LCD1.32(DB17) U4.36(LTDC_R1)
LCD_D18: LCD1.33(DB18) U4.35(LTDC_R2)
LCD_D19: LCD1.34(DB19) U4.46(LTDC_R3)
LCD_D20: LCD1.35(DB20) U4.41(LTDC_R4)
LCD_D21: LCD1.36(DB21) U4.26(LTDC_R5)
LCD_D22: LCD1.37(DB22) U4.47(LTDC_R6)
LCD_D23: LCD1.38(DB23) U4.91(LTDC_R7)
NetC25_2: C25.2 D4.2(K) LCD1.50(A) LCD1.51(A)
NetD4_1: D4.1(A) L1.1 U8.1(SW)
NetLCD1_8: LCD1.8(SDI) ; port CTS_SDI
NetLCD1_9: LCD1.9(CS) ; port CTS_NCS
NetLCD1_11: LCD1.11(WR) ; port CTS_SCK
NetLCD1_40: LCD1.40(DE) U4.22(LTDC_DE)
NetLCD1_41: LCD1.41(PCLK) U4.92(LTDC_CLK)
NetLCD1_42: LCD1.42(HSYNC) U4.96(LTDC_HSYNC)
NetLCD1_43: LCD1.43(VSYNC) U4.40(LTDC_VSYNC)
NetLCD1_45: LCD1.45(K1) LCD1.46(K2) LCD1.47(K3) LCD1.48(K4) LCD1.49(K5) R23.2 U8.3(FB)
NetU2_10: U8.4(EN) ; port CTS_BLK

Not connected (* = marked no-connect by the designer): LCD1 7(TE)* 44(PWM)*

### Notes on the sheet
- (in symbol IPS_CT, part A) IPS MAIN
- (in symbol IPS_CT, part C) RGB SYNC
- (in symbol STM32H743ZIT6, part D) LTDC Interface

### Library data of the parts
C23 = 0603 4.7uF (475) 10% 16V: 贴片电容; ComponentLink1Description: 供应商链接; ComponentLink1URL: http://www.szlcsc.com/product/details_20375.html; Package: 0603; Supplier: LC; SuppliersPartNumber: C19666
C24 C25 = 0603 100nF (104) 10% 50V: 贴片电容; ComponentLink1Description: 供应商链接; ComponentLink1URL: http://www.szlcsc.com/product/details_15331.html; Package: 0603; Supplier: LC; SuppliersPartNumber: C14663
R23 = 0603 5.1Ω (5R10) 1%: 贴片电阻; ComponentLink1Description: 供应商链接; ComponentLink1URL: http://www.szlcsc.com/product/details_25940.html; Package: 0603; Supplier: LC; SuppliersPartNumber: C25197
D4 = SS14: Published: 8-Jun-2000; LatestRevisionDate: 17-Jul-2002; LatestRevisionNote: Re-released for DXP Platform.; PackageReference: SMB; Publisher: Altium Limited; PackageDescription: DO-214-AA/SMB; 2 C-Bend Leads; Body 5.3 x 3.6 mm, inc. leads (LxW); Code_JEDEC: DO-214-AA

## Sheet ngh-audio.SchDoc
size A4
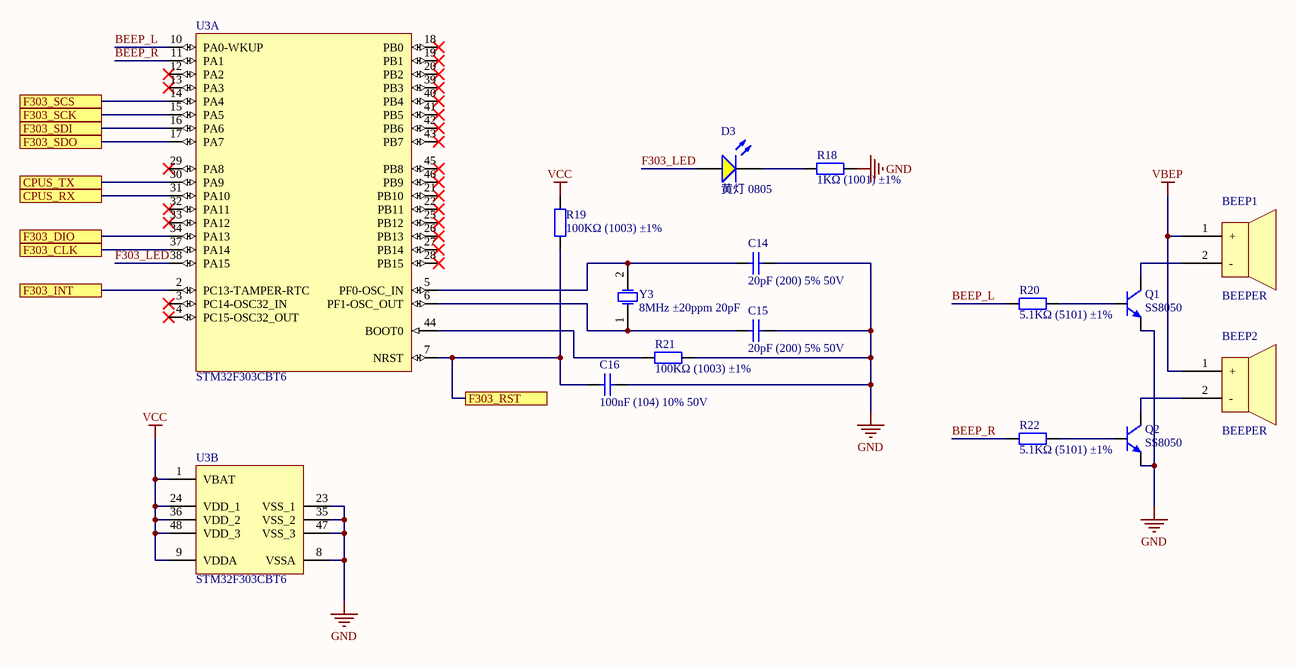
[diagram p5: ngh-audio.SchDoc]

### Parts
BEEP1  BEEPER  [BEEPER]
BEEP2  BEEPER  [BEEPER]
C14  20pF (200) 5% 50V  [0603_C]
C15  20pF (200) 5% 50V  [0603_C]
C16  100nF (104) 10% 50V  [0603_C]
D3  黄灯 0805  [0805_LED_S1]
Q1  SS8050  [SOT23-3M]
Q2  SS8050  [SOT23-3M]
R18  1KΩ (1001) ±1%  [0603_R]
R19  100KΩ (1003) ±1%  [0603_R]
R20  5.1KΩ (5101) ±1%  [0603_R]
R21  100KΩ (1003) ±1%  [0603_R]
R22  5.1KΩ (5101) ±1%  [0603_R]
U3  STM32F303CBT6  [LQFP-48_7x7x05P]  (parts A,B of 2)
Y3  8MHz ±20ppm 20pF  [SMD-5032_2P]

### Ports
CPUS_RX, CPUS_TX, F303_CLK, F303_DIO, F303_INT, F303_RST, F303_SCK, F303_SCS, F303_SDI, F303_SDO

### Nets
GND: C14.2 C15.2 C16.1 Q1.2(E) Q2.2(E) R18.2 R21.2 U3.8(VSSA) U3.23(VSS_1) U3.35(VSS_2) U3.47(VSS_3)
VBEP: BEEP1.1(+) BEEP2.1(+)  [project net OUT_3V3C]
VCC: R19.2 U3.1(VBAT) U3.9(VDDA) U3.24(VDD_1) U3.36(VDD_2) U3.48(VDD_3)  [project net OUT_3V3A]
BEEP_L: R20.1 U3.10(PA0-WKUP)
BEEP_R: R22.1 U3.11(PA1)
CPUS_RX: U3.31(PA10) ; port CPUS_RX
CPUS_TX: U3.30(PA9) ; port CPUS_TX
F030_DIO: U3.34(PA13) ; port F303_DIO
F303_CLK: U3.37(PA14) ; port F303_CLK
F303_INT: U3.2(PC13-TAMPER-RTC) ; port F303_INT
F303_LED: D3.A U3.38(PA15)
F303_RST: C16.2 R19.1 U3.7(NRST) ; port F303_RST
F303_SCS: U3.14(PA4) ; port F303_SCS
SPI1_SCK: U3.15(PA5) ; port F303_SCK
SPI1_SDI: U3.17(PA7) ; port F303_SDO
SPI1_SDO: U3.16(PA6) ; port F303_SDI
NetBEEP1_2: BEEP1.2(-) Q1.3(C)
NetBEEP2_2: BEEP2.2(-) Q2.3(C)
NetC14_1: C14.1 U3.5(PF0-OSC_IN) Y3.2(OSC2)
NetC15_1: C15.1 U3.6(PF1-OSC_OUT) Y3.1(OSC1)
NetD3_K: D3.K R18.1
NetQ1_1: Q1.1(B) R20.2
NetQ2_1: Q2.1(B) R22.2
NetR21_1: R21.1 U3.44(BOOT0)

Not connected (* = marked no-connect by the designer): U3 3(PC14-OSC32_IN)* 4(PC15-OSC32_OUT)* 12(PA2)* 13(PA3)* 18(PB0)* 19(PB1)* 20(PB2)* 21(PB10)* 22(PB11)* 25(PB12)* 26(PB13)* 27(PB14)* 28(PB15)* 29(PA8)* 32(PA11)* 33(PA12)* 39(PB3)* 40(PB4)* 41(PB5)* 42(PB6)* 43(PB7)* 45(PB8)* 46(PB9)*

### Library data of the parts
C14 C15 = 0603 20pF (200) 5% 50V: 贴片电容; ComponentLink1Description: 供应商链接; ComponentLink1URL: http://www.szlcsc.com/product/details_2000.html; Package: 0603; Supplier: LC; SuppliersPartNumber: C1648
C16 = 0603 100nF (104) 10% 50V: 贴片电容; ComponentLink1Description: 供应商链接; ComponentLink1URL: http://www.szlcsc.com/product/details_15331.html; Package: 0603; Supplier: LC; SuppliersPartNumber: C14663
D3 = 0805 黄灯: 发光二极管; ComponentLink1Description: 供应商链接; ComponentLink1URL: http://www.szlcsc.com/product/details_2669.html; Package: 0805; Supplier: LC; SuppliersPartNumber: C2296
Q1 Q2 = 8050-SMD: 高频放大-NPN型; 版权归属: 源创客; 属性: 40V 1.5A 1W 100MHZ; BOM名称: 高频放大-NPN型; 学习资源: www.ooocke.com
R18 = 0603 1KΩ (1001) 1%: 贴片电阻; ComponentLink1Description: 供应商链接; ComponentLink1URL: http://www.szlcsc.com/product/details_21904.html; Package: 0603; Supplier: LC; SuppliersPartNumber: C21190
R19 R21 = 0603 100KΩ (1003) 1%: 贴片电阻; ComponentLink1Description: 供应商链接; ComponentLink1URL: http://www.szlcsc.com/product/details_26546.html; Package: 0603; Supplier: LC; SuppliersPartNumber: C25803
R20 R22 = 0603 5.1KΩ (5101) 1%: 贴片电阻; ComponentLink1Description: 供应商链接; ComponentLink1URL: http://www.szlcsc.com/product/details_23913.html; Package: 0603; Supplier: LC; SuppliersPartNumber: C23186
U3 = STM32F303CBT6: ARM; ComponentLink1Description: 供应商链接; ComponentLink1URL: http://www.szlcsc.com/product/details_9243.html; Package: LQFP-48_7x7x05P; Supplier: LC; SuppliersPartNumber: C8734
Y3 = SMD-5032_2P 8MHz 20ppm 20pF: 贴片晶振; ComponentLink1Description: 供应商链接; ComponentLink1URL: http://www.szlcsc.com/product/details_117214.html; Package: SMD-5032_2P; Supplier: LC; SuppliersPartNumber: C115962

## Sheet ngh-dram.SchDoc
size A4
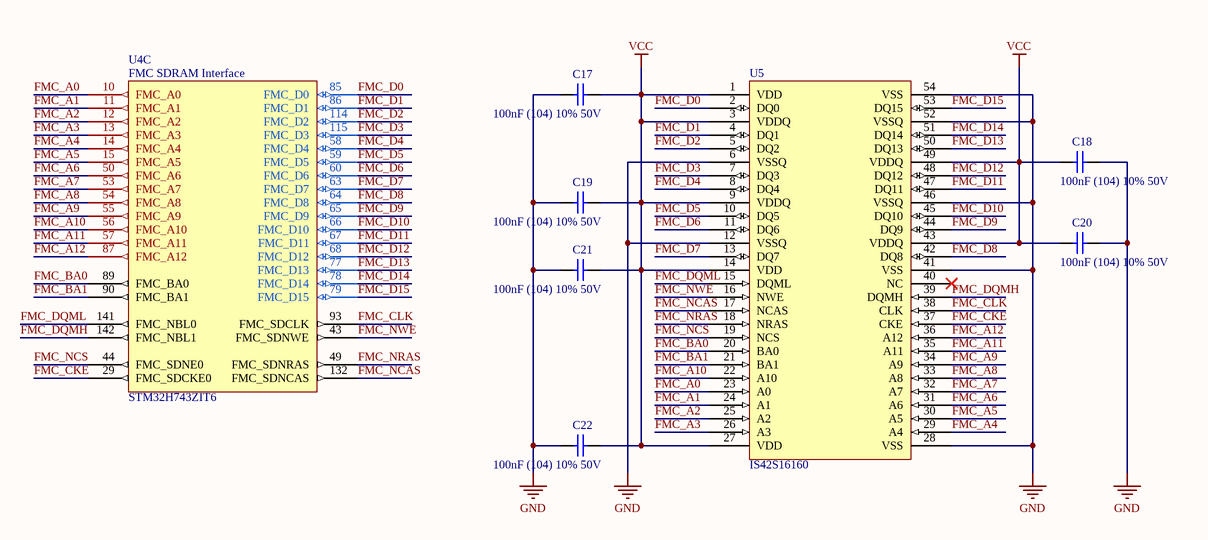
[diagram p6: ngh-dram.SchDoc]

### Parts
C17  100nF (104) 10% 50V  [0603_C]
C18  100nF (104) 10% 50V  [0603_C]
C19  100nF (104) 10% 50V  [0603_C]
C20  100nF (104) 10% 50V  [0603_C]
C21  100nF (104) 10% 50V  [0603_C]
C22  100nF (104) 10% 50V  [0603_C]
U4  STM32H743ZIT6  [LQFP-144_20x20]  (part C of 6)
U5  IS42S16160  [TSOP54-II]

### Nets
GND: C17.2 C18.1 C19.2 C20.1 C21.2 C22.2 U5.6(VSSQ) U5.12(VSSQ) U5.28(VSS) U5.41(VSS) U5.46(VSSQ) U5.52(VSSQ) U5.54(VSS)
VCC: C17.1 C18.2 C19.1 C20.2 C21.1 C22.1 U5.1(VDD) U5.3(VDDQ) U5.9(VDDQ) U5.14(VDD) U5.27(VDD) U5.43(VDDQ) U5.49(VDDQ)  [project net OUT_3V3A]
FMC_A0: U4.10(FMC_A0) U5.23(A0)
FMC_A1: U4.11(FMC_A1) U5.24(A1)
FMC_A2: U4.12(FMC_A2) U5.25(A2)
FMC_A3: U4.13(FMC_A3) U5.26(A3)
FMC_A4: U4.14(FMC_A4) U5.29(A4)
FMC_A5: U4.15(FMC_A5) U5.30(A5)
FMC_A6: U4.50(FMC_A6) U5.31(A6)
FMC_A7: U4.53(FMC_A7) U5.32(A7)
FMC_A8: U4.54(FMC_A8) U5.33(A8)
FMC_A9: U4.55(FMC_A9) U5.34(A9)
FMC_A10: U4.56(FMC_A10) U5.22(A10)
FMC_A11: U4.57(FMC_A11) U5.35(A11)
FMC_A12: U4.87(FMC_A12) U5.36(A12)
FMC_BA0: U4.89(FMC_BA0) U5.20(BA0)
FMC_BA1: U4.90(FMC_BA1) U5.21(BA1)
FMC_CKE: U4.29(FMC_SDCKE0) U5.37(CKE)
FMC_CLK: U4.93(FMC_SDCLK) U5.38(CLK)
FMC_D0: U4.85(FMC_D0) U5.2(DQ0)
FMC_D1: U4.86(FMC_D1) U5.4(DQ1)
FMC_D2: U4.114(FMC_D2) U5.5(DQ2)
FMC_D3: U4.115(FMC_D3) U5.7(DQ3)
FMC_D4: U4.58(FMC_D4) U5.8(DQ4)
FMC_D5: U4.59(FMC_D5) U5.10(DQ5)
FMC_D6: U4.60(FMC_D6) U5.11(DQ6)
FMC_D7: U4.63(FMC_D7) U5.13(DQ7)
FMC_D8: U4.64(FMC_D8) U5.42(DQ8)
FMC_D9: U4.65(FMC_D9) U5.44(DQ9)
FMC_D10: U4.66(FMC_D10) U5.45(DQ10)
FMC_D11: U4.67(FMC_D11) U5.47(DQ11)
FMC_D12: U4.68(FMC_D12) U5.48(DQ12)
FMC_D13: U4.77(FMC_D13) U5.50(DQ13)
FMC_D14: U4.78(FMC_D14) U5.51(DQ14)
FMC_D15: U4.79(FMC_D15) U5.53(DQ15)
FMC_DQMH: U4.142(FMC_NBL1) U5.39(DQMH)
FMC_DQML: U4.141(FMC_NBL0) U5.15(DQML)
FMC_NCAS: U4.132(FMC_SDNCAS) U5.17(NCAS)
FMC_NCS: U4.44(FMC_SDNE0) U5.19(NCS)
FMC_NRAS: U4.49(FMC_SDNRAS) U5.18(NRAS)
FMC_NWE: U4.43(FMC_SDNWE) U5.16(NWE)

Not connected (* = marked no-connect by the designer): U5 40(NC)*

### Notes on the sheet
- (in symbol STM32H743ZIT6, part C) FMC SDRAM Interface

### Library data of the parts
C17-C22 = 0603 100nF (104) 10% 50V: 贴片电容; ComponentLink1Description: 供应商链接; ComponentLink1URL: http://www.szlcsc.com/product/details_15331.html; Package: 0603; Supplier: LC; SuppliersPartNumber: C14663

## Nets that join several sheets
GND: ngh-main (17 pins), st-link (26 pins), ngh-power (36 pins), ngh-ioctl (19 pins), ngh-lcd (9 pins), ngh-audio (11 pins), ngh-dram (13 pins)
OUT_3V3A: ngh-main (8 pins), st-link (C4.2 C5.2 VR1.2 VR3.2), ngh-power (29 pins), ngh-ioctl (8 pins), ngh-lcd (10 pins), ngh-audio (6 pins), ngh-dram (13 pins)
OUT_3V3C: ngh-main (JP1.4), st-link (C10.2 VR4.2), ngh-power (C45.2 VR7.2), ngh-audio (BEEP1.1 BEEP2.1)
CPUS_RX: ngh-main (U4.101), ngh-ioctl (U2.31), ngh-audio (U3.31)
CPUS_TX: ngh-main (U4.137), ngh-ioctl (U2.30), ngh-audio (U3.30)
CTS_RST: ngh-ioctl (LCD1.55 U2.35), ngh-lcd (LCD1.13)
F030_CLK: ngh-main (S2.2), ngh-ioctl (U2.37)
F030_DIO: ngh-main (U4.105), st-link (R3.2 U1.27), ngh-ioctl (U2.34), ngh-audio (U3.34)
F030_INT: ngh-main (U4.118), ngh-ioctl (U2.2)
F030_RST: ngh-main (S2.6 U4.2), ngh-ioctl (C13.2 R13.1 U2.7)
F030_SCS: ngh-main (U4.110), ngh-ioctl (U2.14)
F303_CLK: ngh-main (S2.1), ngh-audio (U3.37)
F303_INT: ngh-main (U4.119), ngh-audio (U3.2)
F303_RST: ngh-main (S2.5 U4.19), ngh-audio (C16.2 R19.1 U3.7)
F303_SCS: ngh-main (U4.34), ngh-audio (U3.14)
H743_RST: ngh-main (S2.8), ngh-power (B1.2 C27.2 R24.1 U4.25)
NetLCD1_8: ngh-ioctl (U2.12), ngh-lcd (LCD1.8)
NetLCD1_9: ngh-ioctl (U2.11), ngh-lcd (LCD1.9)
NetLCD1_11: ngh-ioctl (U2.13), ngh-lcd (LCD1.11)
NetU2_10: ngh-ioctl (U2.10), ngh-lcd (U8.4)
SPI1_SCK: ngh-main (U4.133), ngh-ioctl (U2.15), ngh-audio (U3.15)
SPI1_SDI: ngh-main (U4.135), ngh-ioctl (U2.17), ngh-audio (U3.17)
SPI1_SDO: ngh-main (U4.134), ngh-ioctl (U2.16), ngh-audio (U3.16)
STCLK: ngh-main (S2.3), st-link (U1.26)
STRST: ngh-main (S2.7), st-link (U1.18)
USB_FS_DM: ngh-main (U4.103), ngh-power (R27.2)
USB_FS_DP: ngh-main (U4.104), ngh-power (R26.2)
USB_HS_DM: ngh-main (U4.75), ngh-power (R31.2)
USB_HS_DP: ngh-main (U4.76), ngh-power (R30.2)
USB_HS_ID: ngh-main (U4.73), ngh-power (USB3.4)